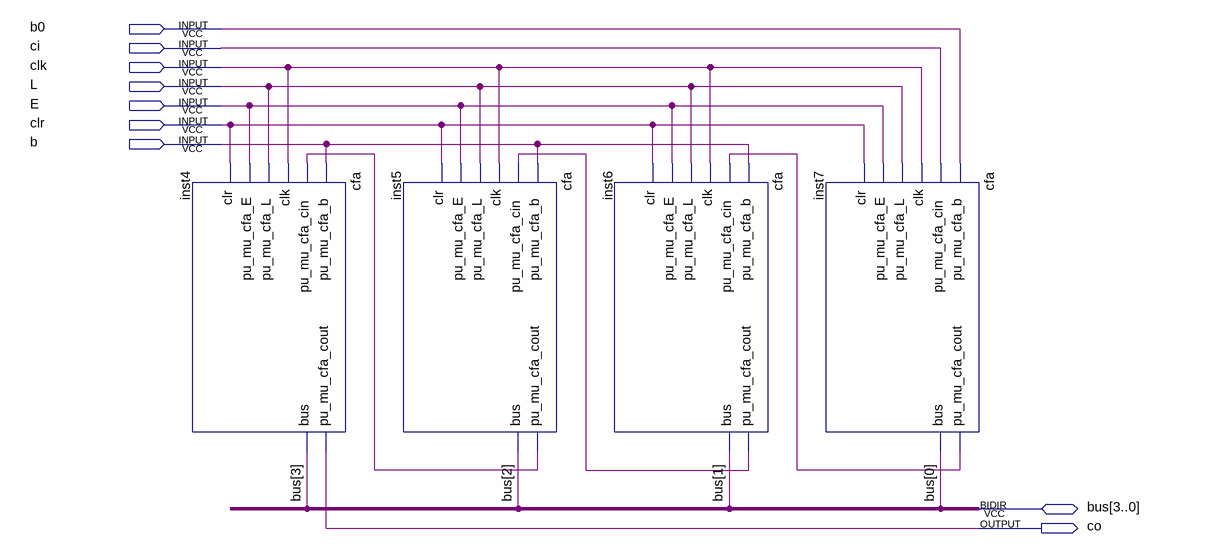
[diagram p0: schematic sheet]
// Quartus schematic jshq0.bdf as structural Verilog: 4 symbols, 9 pins
module jshq0 (
  input  b0,
  input  ci,
  input  clk,
  input  L,
  input  E,
  input  clr,
  input  b,
  inout  [3:0] bus,
  output co
);

  wire inst5_pu_mu_cfa_cout, inst6_pu_mu_cfa_cout, inst7_pu_mu_cfa_cout;

  cfa inst4 (
    .pu_mu_cfa_b(b), .pu_mu_cfa_cin(inst5_pu_mu_cfa_cout), .clk(clk), .pu_mu_cfa_L(L), .pu_mu_cfa_E(E),
    .clr(clr), .pu_mu_cfa_cout(co), .bus(bus[3]));
  cfa inst5 (
    .pu_mu_cfa_b(b), .pu_mu_cfa_cin(inst6_pu_mu_cfa_cout), .clk(clk), .pu_mu_cfa_L(L), .pu_mu_cfa_E(E),
    .clr(clr), .pu_mu_cfa_cout(inst5_pu_mu_cfa_cout), .bus(bus[2]));
  cfa inst6 (
    .pu_mu_cfa_b(b), .pu_mu_cfa_cin(inst7_pu_mu_cfa_cout), .clk(clk), .pu_mu_cfa_L(L), .pu_mu_cfa_E(E),
    .clr(clr), .pu_mu_cfa_cout(inst6_pu_mu_cfa_cout), .bus(bus[1]));
  cfa inst7 (
    .pu_mu_cfa_b(b0), .pu_mu_cfa_cin(ci), .clk(clk), .pu_mu_cfa_L(L), .pu_mu_cfa_E(E), .clr(clr),
    .pu_mu_cfa_cout(inst7_pu_mu_cfa_cout), .bus(bus[0]));
endmodule
